# EAGLE design demo_IB2 (EAGLE 9.6.2)
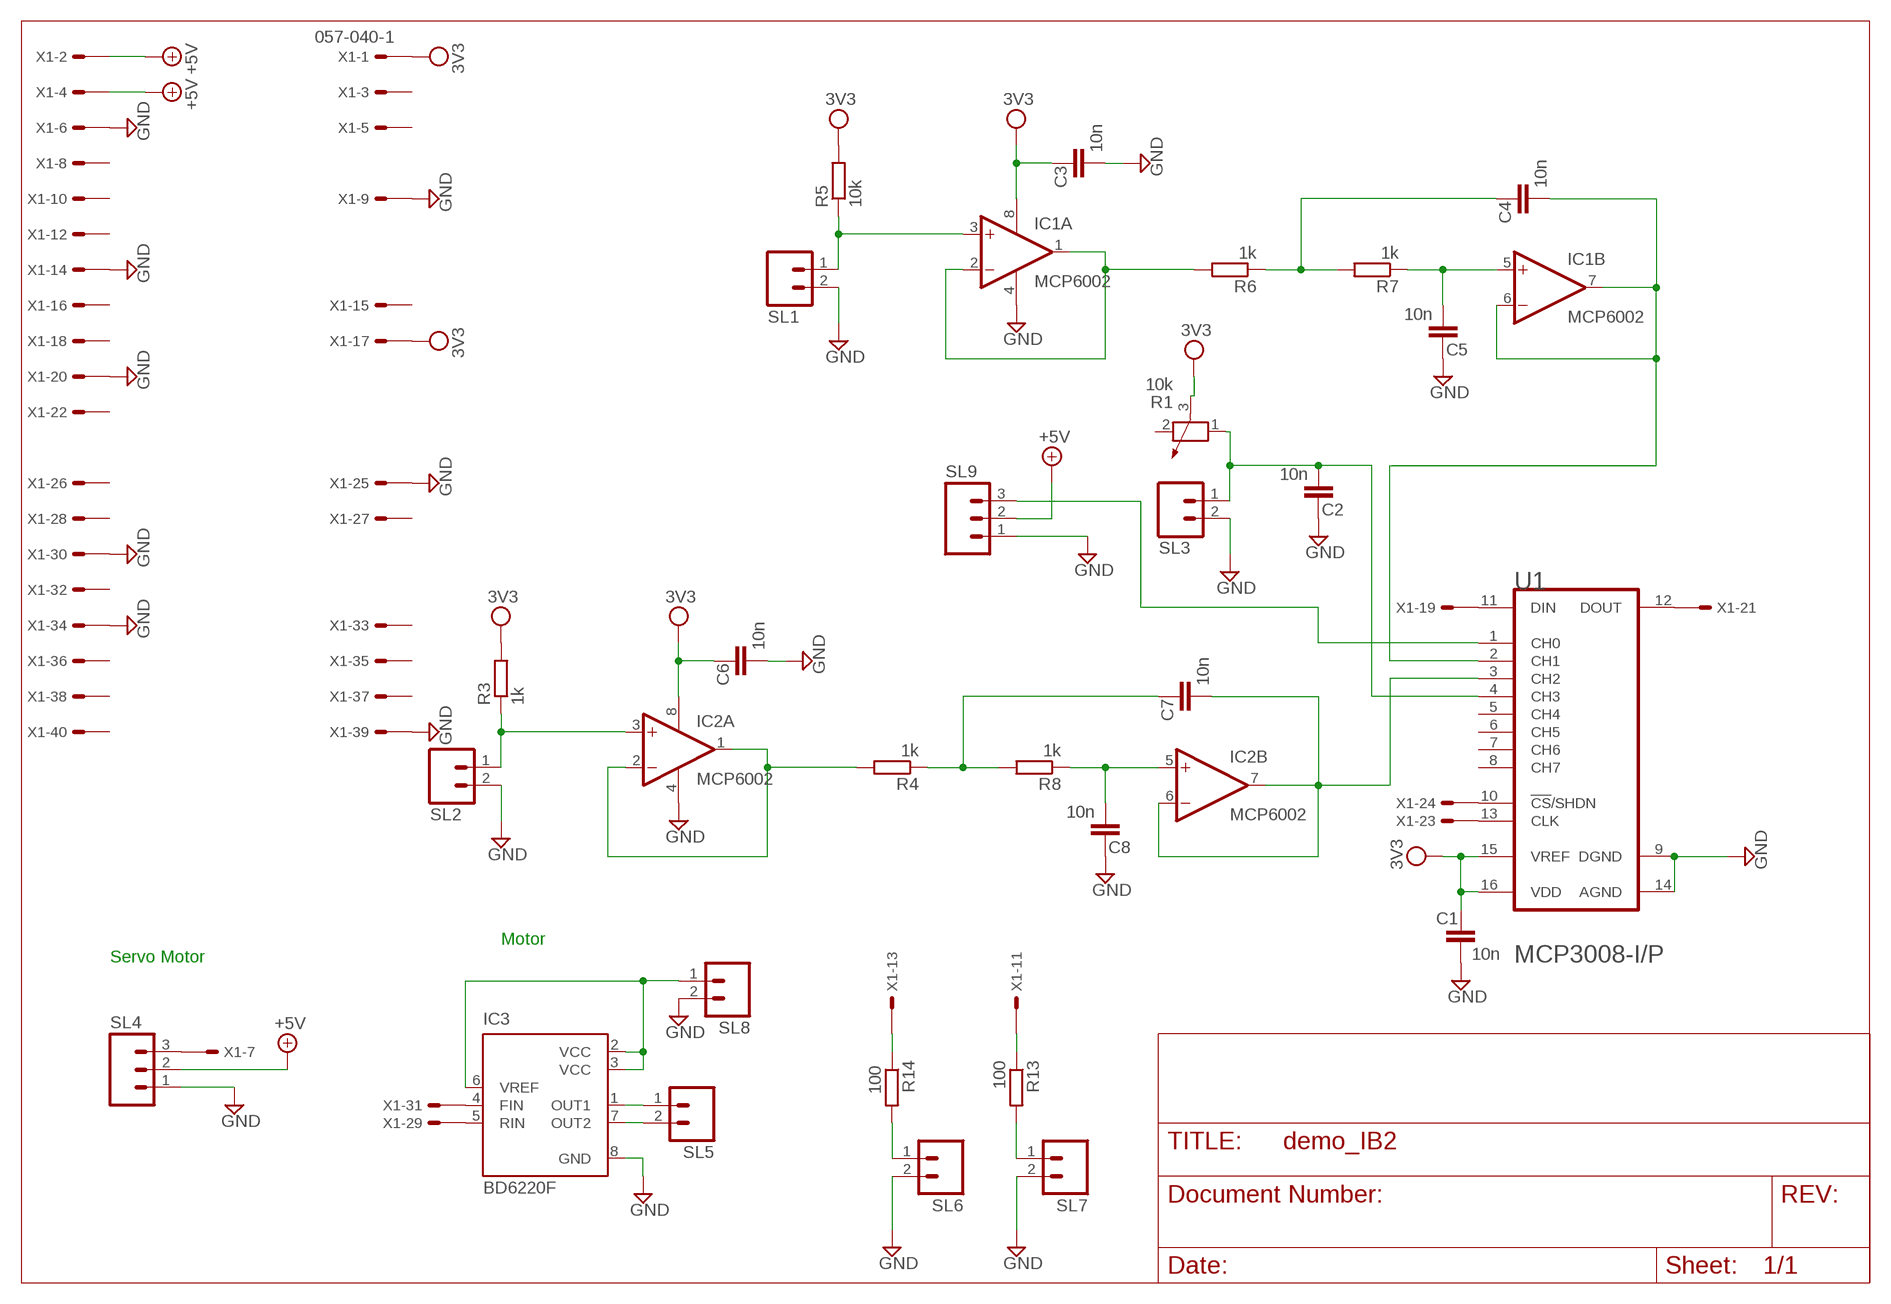
[diagram p0: schematic, sheet 1]

## Parts
C1  10n  C-EUC0805  [C0805]
C2  10n  C-EUC0805  [C0805]
C3  10n  C-EUC0805  [C0805]
C4  10n  C-EUC0805  [C0805]
C5  10n  C-EUC0805  [C0805]
C6  10n  C-EUC0805  [C0805]
C7  10n  C-EUC0805  [C0805]
C8  10n  C-EUC0805  [C0805]
IC1  MCP6002  MCP602SN  [SO08]
IC2  MCP6002  MCP602SN  [SO08]
IC3  BD6220F  [SOP8]
R1  10k  POTENTIOMETER_PT-10  [PT-10]
R3  1k  R-EU_R0805  [R0805]
R4  1k  R-EU_R0805  [R0805]
R5  10k  R-EU_R0805  [R0805]
R6  1k  R-EU_R0805  [R0805]
R7  1k  R-EU_R0805  [R0805]
R8  1k  R-EU_R0805  [R0805]
R13  100  R-EU_R0805  [R0805]
R14  100  R-EU_R0805  [R0805]
SL1  M02  [02P]
SL2  M02  [02P]
SL3  M02  [02P]
SL4  M03  [03P]
SL5  M02  [02P]
SL6  M02  [02P]
SL7  M02  [02P]
SL8  M02  [02P]
SL9  M03  [03P]
U1  MICROCHIP_MCP3008-I-P  [SO-16]
X1  057-040-1  [057-040-1]

## Nets
+5V: SL4.2 SL9.2 X1.2 X1.4
GND: C1.2 C2.1 C3.2 C5.1 C6.2 C8.1 IC1.4(P:V-) IC2.4(P:V-) IC3.8(GND) SL1.2 SL2.2 SL3.2 SL4.1 SL6.2 SL7.2 SL8.2 SL9.1 U1.9(DGND) U1.14(AGND) X1.6 X1.9 X1.14 X1.20 X1.25 X1.30 X1.34 X1.39
N$1: C2.2 R1.1 SL3.1 U1.4(CH3)
N$2: IC2.3(A:+IN) R3.1 SL2.1
N$3: IC2.1(A:OUT) IC2.2(A:-IN) R4.2
N$4: C7.2 IC2.6(B:-IN) IC2.7(B:OUT) U1.3(CH2)
N$5: IC1.3(A:+IN) R5.1 SL1.1
N$6: IC1.1(A:OUT) IC1.2(A:-IN) R6.2
N$7: U1.11(DIN) X1.19
N$8: U1.12(DOUT) X1.21
N$9: U1.13(CLK) X1.23
N$10: U1.10(!CS!/SHDN) X1.24
N$11: C4.2 IC1.6(B:-IN) IC1.7(B:OUT) U1.2(CH1)
N$12: C4.1 R6.1 R7.2
N$13: C7.1 R4.1 R8.2
N$14: C5.2 IC1.5(B:+IN) R7.1
N$15: C8.2 IC2.5(B:+IN) R8.1
N$16: SL9.3 U1.1(CH0)
N$17: IC3.2(VCC) IC3.3(VCC) IC3.6(VREF) SL8.1
N$18: IC3.5(RIN) X1.29
N$19: IC3.4(FIN) X1.31
N$20: SL4.3 X1.7
N$21: IC3.1(OUT1) SL5.1
N$23: R14.2 SL6.1
N$24: R14.1 X1.13
N$25: R13.2 SL7.1
N$26: R13.1 X1.11
N$27: IC3.7(OUT2) SL5.2
VCC: C1.1 C3.1 C6.1 IC1.8(P:V+) IC2.8(P:V+) R1.3 R3.2 R5.2 U1.15(VREF) U1.16(VDD) X1.1 X1.17 ; supply symbol labelled 3V3
Unconnected: R1.2 U1.5(CH4) U1.6(CH5) U1.7(CH6) U1.8(CH7) X1.3 X1.5 X1.8 X1.10 X1.12 X1.15 X1.16 X1.18 X1.22 X1.26 X1.27 X1.28 X1.32 X1.33 X1.35 X1.36 X1.37 X1.38 X1.40

## Notes on the sheet
- Motor
- Servo Motor

## Library data of the parts
C1-C8 = rcl:C-EU: CAPACITOR, European symbol; SPICEPREFIX: C
IC1 IC2 = linear:MCP602: Single Op Amp 2.7V to 6.0V Single Supply CMOS Source: http://ww1.microchip.com/downloads/en/DeviceDoc/21314g.pdf
IC3 = rohm:BD6220: H-bridge drivers (18V max.) Source: http://www.farnell.com/datasheets/389117.pdf
R1 = rcl:POTENTIOMETER_: Potentiometer; SPICEMODEL: POT; SPICEPREFIX: X
R3-R8 R13 R14 = rcl:R-EU_: RESISTOR, European symbol; SPICEPREFIX: R
SL1-SL3 SL5-SL8 = con-amp-quick:M02: AMP QUICK CONNECTOR; OC_FARNELL: unknown; OC_NEWARK: unknown
SL4 SL9 = con-amp-quick:M03: AMP QUICK CONNECTOR; OC_FARNELL: unknown; OC_NEWARK: unknown
U1 = P:MICROCHIP_MCP3008-I-P: CON-ADC-MCP3008-16
X1 = con-panduit:057-040-: CONNECTOR 40-pin series 057 contact pc board low profile headers; OC_FARNELL: unknown; OC_NEWARK: unknown

## Board
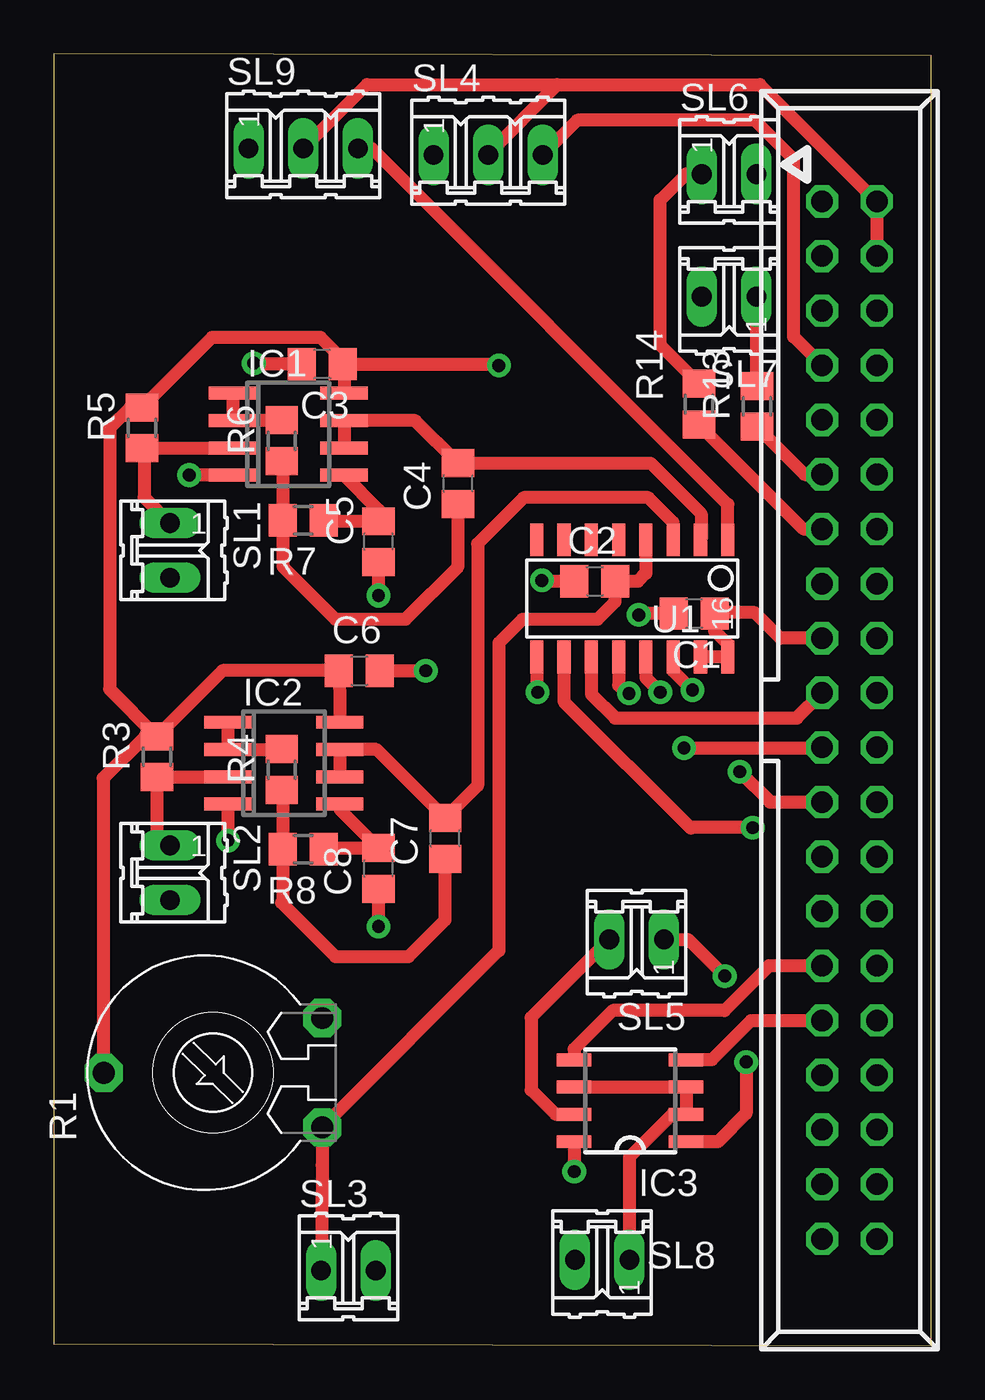
[diagram p1: board, top side]
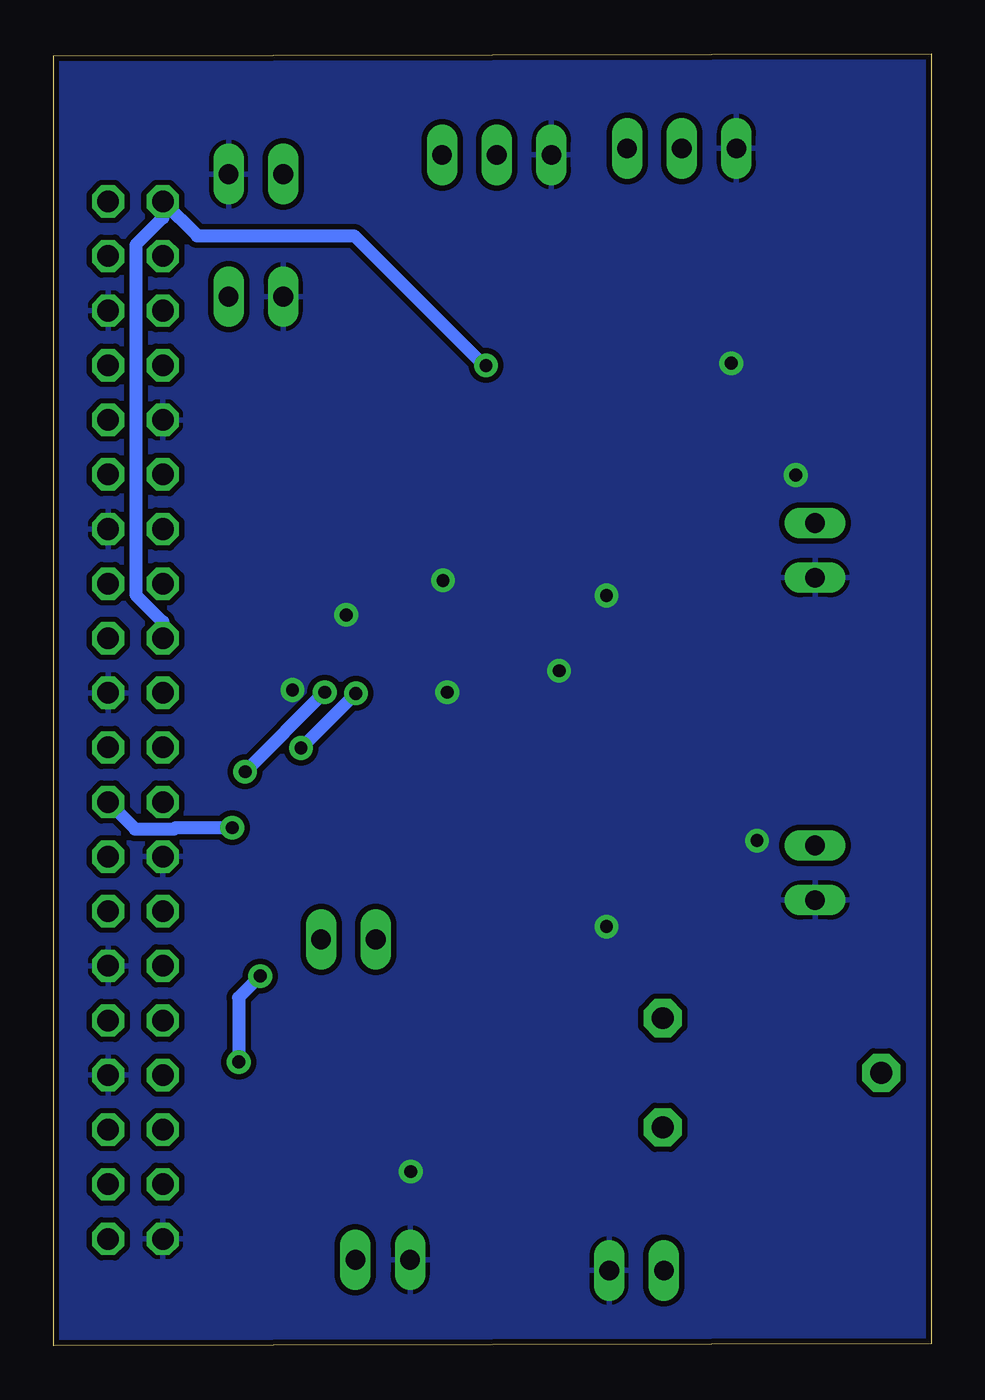
[diagram p2: board, bottom side, seen from below]

Size 40.8 x 60.1 mm. Coordinates in mm from the lower left corner, seen from the top.
Outline: 0,0.1 40.8,0 40.8,60 0,60.1 0,0.1
Copper layers (1*16): Top 0.018mm / dielectric 1.55mm / Bottom 0.018mm
Design rules "Eurocircuits_GT_panel": minimum track width 0.25mm, minimum drill 0.35mm, track to track 0.2mm, track to pad 0.2mm, pad to pad 0.2mm, via to via 0.2mm, smd to smd 0mil, copper to edge 0.25mm, drill to drill 0.35mm, minimum pad ring 0.25mm, minimum via ring 0.25mm, stop-mask expansion 0mil, vias tented up to drill 0.45mm, thermal gap 0.2mm

### Footprints (pad centres in the part's own frame; a part is rotated, then mirrored left to right if it is on the bottom)
C0805 = smd 1.3 x 1.5: 1 -0.95,0; 2 0.95,0
SO08 = smd 0.6 x 2.2: 1 -1.905,-2.6; 2 -0.635,-2.6; 3 0.635,-2.6; 4 1.905,-2.6; 5 1.905,2.6; 6 0.635,2.6; 7 -0.635,2.6; 8 -1.905,2.6
SOP8 = smd 0.6 x 1.6: 1 -1.905,-2.6; 2 -0.635,-2.6; 3 0.635,-2.6; 4 1.905,-2.6; 5 1.905,2.6; 6 0.635,2.6; 7 -0.635,2.6; 8 -1.905,2.6
PT-10 = drill 1.016 pad 1.778 octagon: 1 -2.54,-5.08; 2 2.54,-5.08; 3 0,5.08
R0805 = smd 1.3 x 1.5: 1 -0.95,0; 2 0.95,0
02P = drill 0.914 long: 1 -1.27,0; 2 1.27,0
03P = drill 0.914 long: 1 -2.54,0; 2 0,0; 3 2.54,0
SO-16 = smd 0.61 x 1.524: 1 -4.445,-2.794; 2 -3.175,-2.794; 3 -1.905,-2.794; 4 -0.635,-2.794; 5 0.635,-2.794; 6 1.905,-2.794; 7 3.175,-2.794; 8 4.445,-2.794; 9 4.445,2.667; 10 3.175,2.667; 11 1.905,2.667; 12 0.635,2.667; 13 -0.635,2.667; 14 -1.905,2.667; 15 -3.175,2.667; 16 -4.445,2.667
057-040-1 = drill 1 octagon: 1 -24.13,-1.27; 2 -24.13,1.27; 3 -21.59,-1.27; 4 -21.59,1.27; 5 -19.05,-1.27; 6 -19.05,1.27; 7 -16.51,-1.27; 8 -16.51,1.27; 9 -13.97,-1.27; 10 -13.97,1.27; 11 -11.43,-1.27; 12 -11.43,1.27; 13 -8.89,-1.27; 14 -8.89,1.27; 15 -6.35,-1.27; 16 -6.35,1.27; 17 -3.81,-1.27; 18 -3.81,1.27; 19 -1.27,-1.27; 20 -1.27,1.27; 21 1.27,-1.27; 22 1.27,1.27; 23 3.81,-1.27; 24 3.81,1.27; 25 6.35,-1.27; 26 6.35,1.27; 27 8.89,-1.27; 28 8.89,1.27; 29 11.43,-1.27; 30 11.43,1.27; 31 13.97,-1.27; 32 13.97,1.27; 33 16.51,-1.27; 34 16.51,1.27; 35 19.05,-1.27; 36 19.05,1.27; 37 21.59,-1.27; 38 21.59,1.27; 39 24.13,-1.27; 40 24.13,1.27

### Placement (x,y rotation side)
C1  29.78,34.06 180 top
C2  25.15,35.56 0 top
C3  12.48,45.66 180 top
C4  18.8,40.1 90 top
C5  15.1,37.4 90 top
C6  14.2,31.4 0 top
C7  18.2,23.6 90 top
C8  15.1,22.2 90 top
IC1  10.9,42.4 270 top
IC2  10.7,27.1 270 top
IC3  26.8,11.4 90 top
R1  7.4,12.7 90 top
R3  4.8,27.4 90 top
R4  10.6,26.8 90 top
R5  4.1,42.7 90 top
R6  10.6,42.1 90 top
R7  11.6,38.4 180 top
R8  11.6,23.1 180 top
R13  32.7,43.7 90 top
R14  30,43.8 90 top
SL1  5.4,37 270 top
SL2  5.4,22 270 top
SL3  13.7,3.5 0 top
SL4  20.2,55.4 0 top
SL5  27.1,18.9 180 top
SL6  31.4,54.5 0 top
SL7  31.4,48.8 180 top
SL8  25.5,4 180 top
SL9  11.6,55.7 0 top
U1  26.9,34.7 180 top
X1  37,29.1 270 top

### Tracks (layer width: path | path; a pad name or v marks a point on that pad's centre or on a via)
+5V
  Top 0.61: X1.4 X1.2 32.84,58.66 23.4,58.66 | 23.4,58.66 14.56,58.66 SL9.2 | SL4.2 20.2,55.46 23.4,58.66
GND  (via drill 0.6)
  Top 0.61: U1.14 28.81,31.39 v29.7,30.5 | U1.9 22.46,30.45 v22.5,30.4 | C5.1 v15.1,34.9 | C8.1 v15.1,19.5 | IC2.4 v8.1,23.5 | IC3.8 v24.2,8.1 | C3.2 9.34,45.66 v9.3,45.7 | IC1.4 v6.3,40.49 v6.3,40.5 | C2.1 22.74,35.56 v22.7,35.6 | C1.2 27.26,34.06 v27.2,34 | C6.2 v17.3,31.4
  pour Bottom (isolate 0.254): -0.9,60.5 -0.9,-1 41.8,-1 41.8,60.5
N$1
  Top 0.61: SL3.1 12.48,8.41 R1.1 20.7,18.38 20.7,32.7 21.8,33.8 25.29,33.8 26.1,34.61 C2.2 27.16,35.56 27.54,35.94 U1.4
N$2
  Top 0.61: SL2.1 4.8,23.87 R3.1 8.09,26.45 IC2.3
N$3
  Top 0.305: 10.59,27.73 R4.2
  Top 0.61: IC2.1 IC2.2 10.59,27.73
N$4
  Top 0.305: 18.32,24.68 C7.2
  Top 0.61: C7.2 15.02,27.73 IC2.7 IC2.6 | U1.3 28.81,38.3 27.65,39.45 21.85,39.45 19.71,37.31 19.71,26.06 18.32,24.68
N$5
  Top 0.61: IC1.3 8.29,41.75 R5.1 4.2,41.65 4.2,39.47 SL1.1
N$6
  Top 0.61: IC1.1 8.32,44.29 8.32,43.05 | IC1.2 8.32,43.05 | 8.32,43.05 R6.2
N$7
  Top 0.61: U1.11 25,30.3 26.1,29.2 34.56,29.2 X1.19
N$8  (via drill 0.6)
  Top 0.61: U1.12 26.27,30.73 26.7,30.3 v26.75,30.35 | v29.3,27.8 35.7,27.8 X1.21
  Bottom 0.61: v26.75,30.35 v29.3,27.8
N$9  (via drill 0.6)
  Top 0.61: U1.13 27.54,31.07 v28.2,30.4 | v31.9,26.7 33.31,25.29 X1.23
  Bottom 0.61: v28.2,30.4 v31.9,26.7
N$10  (via drill 0.6)
  Top 0.61: U1.10 23.72,29.98 29.62,24.08 29.64,24.1 v32.5,24.1
  Bottom 0.61: v32.5,24.1 35.14,24.1 35.21,24.04 37.02,24.04 X1.24
N$11
  Top 0.61: IC1.6 IC1.7 16.82,43.03 C4.2 27.75,41.05 30.1,38.7 30.1,37.52 U1.2
N$12
  Top 0.61: R6.1 10.65,41.1 R7.2 10.65,36.25 13.1,33.8 16.35,33.8 18.8,36.25 C4.1
N$13
  Top 0.61: R4.1 10.65,25.8 R8.2 10.65,20.65 10.6,20.6 13.1,18.1 16.5,18.1 18.2,19.8 C7.1
N$14
  Top 0.61: R7.1 12.6,38.35 C5.2 15.1,38.9 IC1.5
N$15
  Top 0.61: R8.1 12.6,23.15 C8.2 13.3,24.95 IC2.5
N$16
  Top 0.61: U1.1 31.35,39.14 14.78,55.7 SL9.3
N$17
  Top 0.61: IC3.6 IC3.3 IC3.2 28.77,10.77 26.77,8.77 SL8.1
N$18
  Top 0.61: X1.29 33.27,17.67 31.2,15.6 26,15.6 24.2,13.8 IC3.5
N$19
  Top 0.61: X1.31 32.43,15.13 30.61,13.3 IC3.4
N$20
  Top 0.61: X1.7 34.4,46.94 34.4,55.2 32.6,57 24.34,57 SL4.3
N$21  (via drill 0.6)
  Top 0.61: SL5.1 29.5,18.9 v31.2,17.2 | v32.2,13.2 32.2,10.8 30.89,9.49 IC3.1
  Bottom 0.61: v31.2,17.2 32.2,16.2 v32.2,13.2
N$23
  Top 0.61: R14.2 28.2,46.55 28.2,53.3 29.4,54.5 SL6.1
N$24
  Top 0.61: R14.1 34.86,37.99 X1.13
N$25
  Top 0.61: R13.2 32.7,48.77 SL7.1
N$26
  Top 0.61: R13.1 34.92,40.53 X1.11
N$27
  Top 0.61: SL5.2 22.2,15.27 22.2,11.9 23.33,10.77 IC3.7
VCC  (via drill 0.6)
  Top 0.61: IC2.8 13.3,30.25 C6.1 7.85,31.4 R3.2 | U1.15 U1.16 31.35,32.64 30.73,33.26 C1.1 30.77,34.1 32.6,34.1 33.79,32.91 X1.17 | R3.2 2.6,30.55 2.6,42.7 3.55,43.65 R5.2 7.37,46.92 12.39,46.92 13.44,45.88 C3.1 | R3.2 4.25,28.35 2.3,26.4 2.3,12.72 R1.3 | C3.1 13.5,45.6 IC1.8 | C3.1 20.64,45.66 v20.7,45.6
  Bottom 0.61: v20.7,45.6 20.7,45.5 26.83,51.63 34.13,51.63 X1.1 35.73,52.47 36.98,51.21 36.98,34.93 35.73,33.67 X1.17